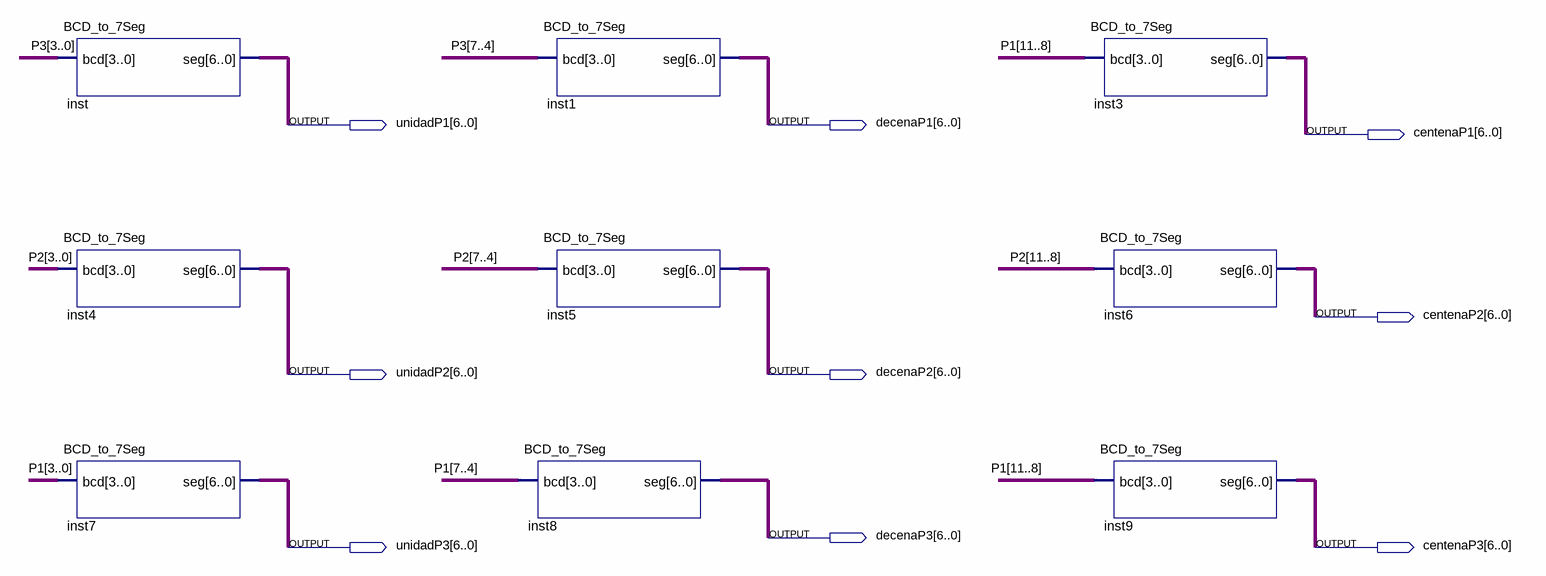
[diagram p0: schematic sheet]
// Quartus schematic Block4.bdf as structural Verilog: 9 symbols, 9 pins
module Block4 (
  output [6:0] unidadP1,
  output [6:0] decenaP1,
  output [6:0] centenaP1,
  output [6:0] centenaP2,
  output [6:0] unidadP2,
  output [6:0] decenaP2,
  output [6:0] decenaP3,
  output [6:0] unidadP3,
  output [6:0] centenaP3
);

  wire [7:0] P3;
  wire [11:0] P1, P2;

  BCD_to_7Seg inst (.bcd(P3[3:0]), .seg(unidadP1));
  BCD_to_7Seg inst4 (.bcd(P2[3:0]), .seg(unidadP2));
  BCD_to_7Seg inst7 (.bcd(P1[3:0]), .seg(unidadP3));
  BCD_to_7Seg inst1 (.bcd(P3[7:4]), .seg(decenaP1));
  BCD_to_7Seg inst5 (.bcd(P2[7:4]), .seg(decenaP2));
  BCD_to_7Seg inst8 (.bcd(P1[7:4]), .seg(decenaP3));
  BCD_to_7Seg inst3 (.bcd(P1[11:8]), .seg(centenaP1));
  BCD_to_7Seg inst6 (.bcd(P2[11:8]), .seg(centenaP2));
  BCD_to_7Seg inst9 (.bcd(P1[11:8]), .seg(centenaP3));
endmodule
